# Altium schematic sheet Rail_3.SchDoc: Half Bridge 3
size A4; DocumentNumber: 5; Revision: 1.1; SheetNumber: 5; SheetTotal: 6
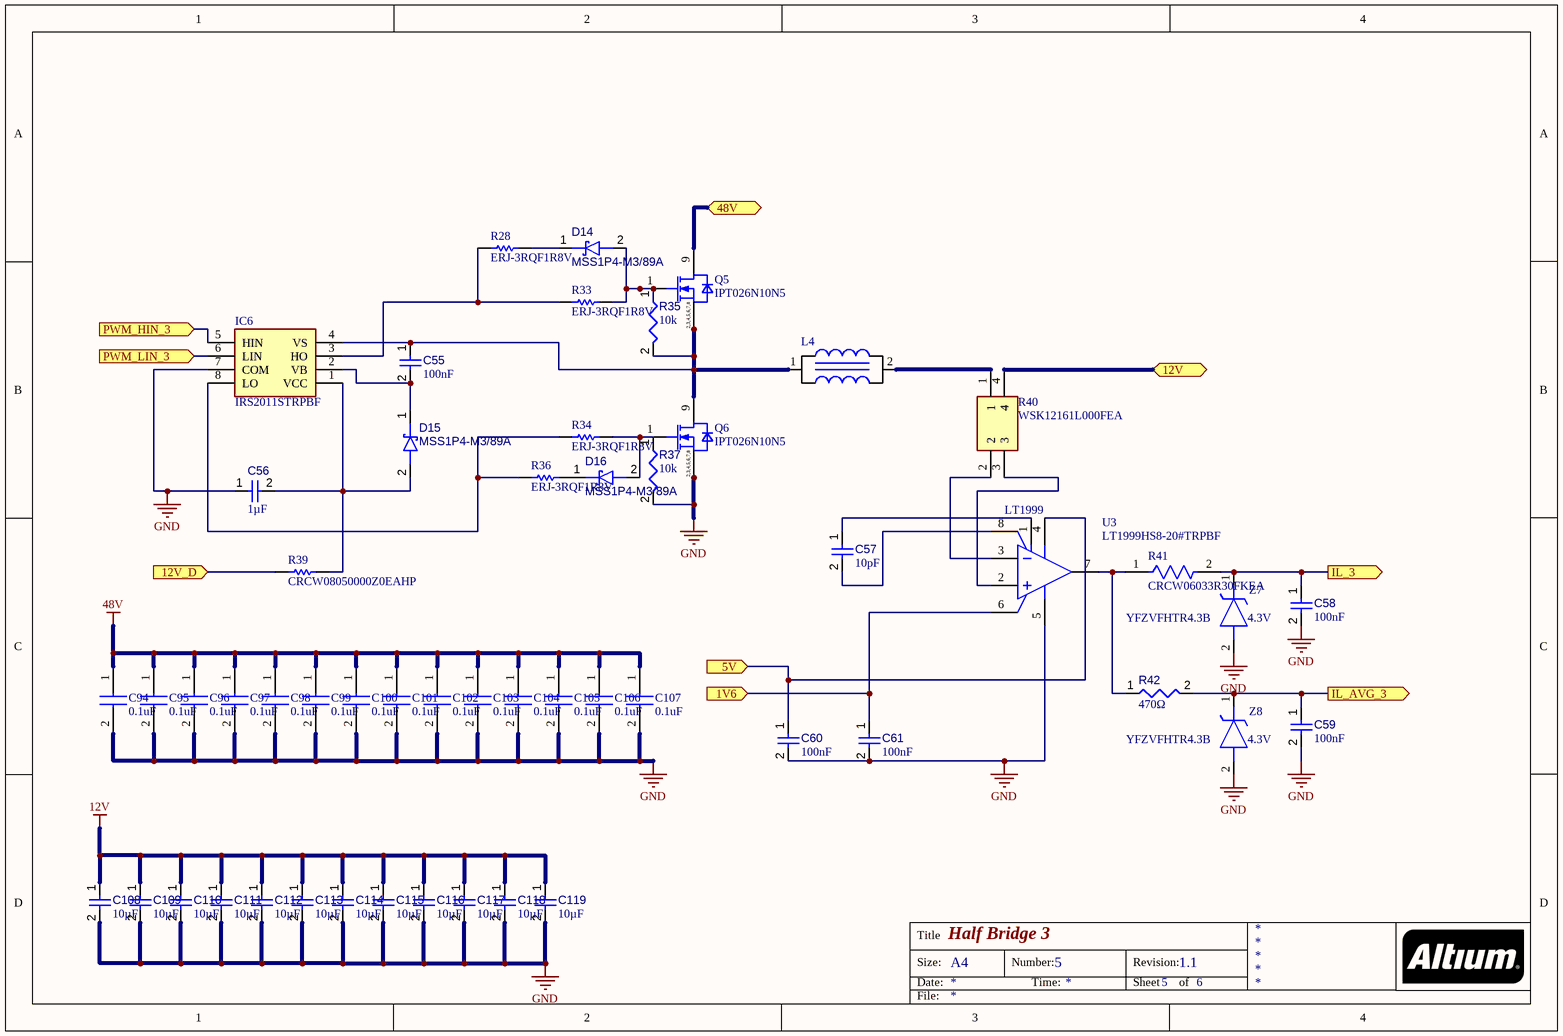
[diagram p0: Rail_3.SchDoc]

## Parts
C55  value 100nF  [CAPC1608X90X40ML10T20]  (hidden comment: Capacitor 100 nF +/-10% 50 V 0603)
C56  value 1µF  [CAPC0603(1608)100_L]  (hidden comment: Capacitor 1µF +/-0.1% 25V 0603)
C57  value 10pF  [CAPC1608X87X35ML15T15]  (hidden comment: Capacitor 10 pF +/- 0.25 pF 50 V 0603)
C58  value 100nF  [CAPC1608X90X40ML10T20]  (hidden comment: Capacitor 100 nF +/-10% 50 V 0603)
C59  value 100nF  [CAPC1608X90X40ML10T20]  (hidden comment: Capacitor 100 nF +/-10% 50 V 0603)
C60  value 100nF  [CAPC1608X90X40ML10T20]  (hidden comment: Capacitor 100 nF +/-10% 50 V 0603)
C61  value 100nF  [CAPC1608X90X40ML10T20]  (hidden comment: Capacitor 100 nF +/-10% 50 V 0603)
C94  0.1uF  [CAPC1608X90N]
C95  0.1uF  [CAPC1608X90N]
C96  0.1uF  [CAPC1608X90N]
C97  0.1uF  [CAPC1608X90N]
C98  0.1uF  [CAPC1608X90N]
C99  0.1uF  [CAPC1608X90N]
C100  0.1uF  [CAPC1608X90N]
C101  0.1uF  [CAPC1608X90N]
C102  0.1uF  [CAPC1608X90N]
C103  0.1uF  [CAPC1608X90N]
C104  0.1uF  [CAPC1608X90N]
C105  0.1uF  [CAPC1608X90N]
C106  0.1uF  [CAPC1608X90N]
C107  0.1uF  [CAPC1608X90N]
C108  value 10µF  [CAPC0805(2012)145_L]  (hidden comment: Capacitor 10µF +/-20% 25V 0805)
C109  value 10µF  [CAPC0805(2012)145_L]  (hidden comment: Capacitor 10µF +/-20% 25V 0805)
C110  value 10µF  [CAPC0805(2012)145_L]  (hidden comment: Capacitor 10µF +/-20% 25V 0805)
C111  value 10µF  [CAPC0805(2012)145_L]  (hidden comment: Capacitor 10µF +/-20% 25V 0805)
C112  value 10µF  [CAPC0805(2012)145_L]  (hidden comment: Capacitor 10µF +/-20% 25V 0805)
C113  value 10µF  [CAPC0805(2012)145_L]  (hidden comment: Capacitor 10µF +/-20% 25V 0805)
C114  value 10µF  [CAPC0805(2012)145_L]  (hidden comment: Capacitor 10µF +/-20% 25V 0805)
C115  value 10µF  [CAPC0805(2012)145_L]  (hidden comment: Capacitor 10µF +/-20% 25V 0805)
C116  value 10µF  [CAPC0805(2012)145_L]  (hidden comment: Capacitor 10µF +/-20% 25V 0805)
C117  value 10µF  [CAPC0805(2012)145_L]  (hidden comment: Capacitor 10µF +/-20% 25V 0805)
C118  value 10µF  [CAPC0805(2012)145_L]  (hidden comment: Capacitor 10µF +/-20% 25V 0805)
C119  value 10µF  [CAPC0805(2012)145_L]  (hidden comment: Capacitor 10µF +/-20% 25V 0805)
D14  MSS1P4-M3/89A  [MicroSMP (DO-219AD)]
D15  MSS1P4-M3/89A  [MicroSMP (DO-219AD)]
D16  MSS1P4-M3/89A  [MicroSMP (DO-219AD)]
IC6  IRS2011STRPBF  [SOIC127P600X175-8N-12-V]
L4  Inductor (Ansys)  [Inductor-Footprint-1]  (value not drawn)
Q5  IPT026N10N5  [INF-PG-HSOF-8-1-0-V]
Q6  IPT026N10N5  [INF-PG-HSOF-8-1-0-V]
R28  ERJ-3RQF1R8V  [RESC1608X55X30LL15T15]
R33  ERJ-3RQF1R8V  [RESC1608X55X30LL15T15]
R34  ERJ-3RQF1R8V  [RESC1608X55X30LL15T15]
R35  value 10k  [RESC1608X55X25ML10T15]  (hidden comment: Resistor 10k +/-1% 0603 100 mW)
R36  ERJ-3RQF1R8V  [RESC1608X55X30LL15T15]
R37  value 10k  [RESC1608X55X25ML10T15]  (hidden comment: Resistor 10k +/-1% 0603 100 mW)
R39  CRCW08050000Z0EAHP  [RESC2013X50X30ML20T20]
R40  WSK12161L000FEA  [WSK12161L000FEA]
R41  CRCW06033R30FKEA  [FP-CRCW0603-e3-IPC_C]
R42  value 470Ω  [RESC0805(2012)_L]  (hidden comment: 470R5J)
U3  LT1999HS8-20#TRPBF  [LT-S8-8_L]
Z7  YFZVFHTR4.3B  [YFZVFHTR43B]
Z8  YFZVFHTR4.3B  [YFZVFHTR43B]

## Ports
1V6 (in), 5V (in), 12V (bidir), 12V_D (in), 48V (bidir), IL_3 (out), IL_AVG_3 (out), PWM_HIN_3 (in), PWM_LIN_3 (in)

## Nets
12V: C108.1 C109.1 C110.1 C111.1 C112.1 C113.1 C114.1 C115.1 C116.1 C117.1 C118.1 C119.1
48V: C94.1 C95.1 C96.1 C97.1 C98.1 C99.1 C100.1 C101.1 C102.1 C103.1 C104.1 C105.1 C106.1 C107.1
GND: C56.1 C58.2 C59.2 C60.2 C61.2 C94.2 C95.2 C96.2 C97.2 C98.2 C99.2 C100.2 C101.2 C102.2 C103.2 C104.2 C105.2 C106.2 C107.2 C108.2 C109.2 C110.2 C111.2 C112.2 C113.2 C114.2 C115.2 C116.2 C117.2 C118.2 C119.2 IC6.7(COM) Q6.2(SOURCE) Q6.3(SOURCE) Q6.4(SOURCE) Q6.5(SOURCE) Q6.6(SOURCE) Q6.7(SOURCE) Q6.8(SOURCE) R37.2 U3.5(GND) Z7.2(A) Z8.2(A)
1V6: C61.1 U3.6(REF) ; port 1V6
5V: C60.1 U3.4(V+) ; port 5V
12V: R40.4 ; port 12V  [a separate net that carries the same name]
12V_D: R39.1 ; port 12V_D
48V: Q5.9(DRAIN) ; port 48V  [a separate net that carries the same name]
IL_3: C58.1 R41.2 Z7.1(K) ; port IL_3
IL_AVG_3: C59.1 R42.2 Z8.1(K) ; port IL_AVG_3
PWM_HIN_3: IC6.5(HIN) ; port PWM_HIN_3
PWM_LIN_3: IC6.6(LIN) ; port PWM_LIN_3
NetC55_1: C55.1 IC6.4(VS) L4.1 Q5.2(SOURCE) Q5.3(SOURCE) Q5.4(SOURCE) Q5.5(SOURCE) Q5.6(SOURCE) Q5.7(SOURCE) Q5.8(SOURCE) Q6.9(DRAIN) R35.2
NetC55_2: C55.2 D15.1(K) IC6.2(VB)
NetC56_2: C56.2 D15.2(A) IC6.1(VCC) R39.2
NetC57_1: C57.1 U3.1(V+)
NetC57_2: C57.2 U3.8(~{SHDN})
NetD14_1: D14.1(K) R28.2
NetD14_2: D14.2(A) Q5.1(GATE) R33.2 R35.1
NetD16_1: D16.1(K) R36.2
NetD16_2: D16.2(A) Q6.1(GATE) R34.2 R37.1
NetIC6_3: IC6.3(HO) R28.1 R33.1
NetIC6_8: IC6.8(LO) R34.1 R36.1
NetL4_2: L4.2 R40.1
NetR40_2: R40.2 U3.3(-IN)
NetR40_3: R40.3 U3.2(+IN)
NetR41_1: R41.1 R42.1 U3.7(OUT)

## Notes on the sheet
- (near U3) LT1999
- (near Z7) 4.3V
- (near Z8) 4.3V
- Title
- Size:
- Date:
- A4
- Number:
- Time:
- Revision:
- Sheet
- of
- File:
- (in symbol IPT026N10N5) 2,3,4,5,6,7,8

## Library data of the parts
C55 C58-C61 = CMP-001-00017-4: Chip Capacitor, 100 nF, +/- 10%, 50 V, 0603 (1608 Metric); Capacitor Type: Ceramic; Voltage Rating: 50V; RoHS Compliant: True; Max Operating Temperature: 125°C; Pins: 2; Mounting Technology: SM; Min Operating Temperature: -55°C; Tolerance: 10%; Case/Package: 0603
C56 = CMP-001-00055-2: Chip Capacitor, 1µF +/-0.1%, 25V, 0603, Thickness 1 mm; Tolerance: 20%; Max Operating Temperature: 85°C; Voltage Rating: 25V; Min Operating Temperature: -55°C; Case/Package: 0805; Mounting Technology: SMT; Pins: 2
C57 = CMP-001-00012-4: Chip Capacitor, 10 pF, +/- 0.25 pF, 50 V, 0603 (1608 Metric); Tolerance: 0.25%; Capacitor Type: Ceramic; Voltage Rating: 50V; Min Operating Temperature: -55°C; Mounting Technology: SM; RoHS Compliant: True; Case/Package: 0603; Pins: 2; Max Operating Temperature: 125°C
C94-C107 = 06031C104K4T2A: Capacitor; Manufacturer_Name: AVX; Datasheet Link: https://componentsearchengine.com/Datasheets/1/06031A100FAT2A.pdf; Height: 0.9mm; Manufacturer_Part_Number: 06031C104K4T2A; Mouser Part Number: 581-06031C104K4T2A; Mouser Price/Stock: https://www.mouser.co.uk/ProductDetail/AVX/06031C104K4T2A?qs=7MVldsJ5UaycASOsZ6%2FbJQ%3D%3D
C108-C119 = CMP-001-00079-2: Chip Capacitor, 10µF +/-20%, 25V, 0805, Thickness 1.45 mm; Tolerance: 10%; Pins: 2; Max Operating Temperature: 85°C; Mounting Technology: SMT; Case/Package: 0603; Voltage Rating: 25V; Min Operating Temperature: -55°C
D14-D16 = CMP-004-00024-2: Schottky Diodes & Rectifiers 1.0 Amp 40 Volt; Max Surge Current: 25A; Forward Voltage: 460mV; Pins: 2; Min Operating Temperature: -55°C; Max Operating Temperature: 150°C; Mounting Technology: SMT
IC6 = IRS2011STRPBF: Integrated Circuit; Manufacturer_Name: Infineon; Datasheet Link: https://componentsearchengine.com/Datasheets/1/IRS2011STRPBF.pdf; Height: 1.75mm; Manufacturer_Part_Number: IRS2011STRPBF; Arrow Part Number: IRS2011STRPBF; Arrow Price/Stock: https://www.arrow.com/en/products/irs2011strpbf/infineon-technologies-ag; Mouser Part Number: 942-IRS2011STRPBF; Mouser Price/Stock: https://www.mouser.co.uk/ProductDetail/Infineon-IR/IRS2011STRPBF?qs=9%252BKlkBgLFf3Y4ge8A0TwYQ%3D%3D
L4 = CMP-006-00021-3: Ansys 3D Model
Q5 Q6 = IPT026N10N5: Insulated-Gate Field-Effect Transistor (IGFET), N-Channel, Enhancement, Body Diode, Pin 1 Gate, 2-8 Source, 9 Drain, 9 Pins; Manufacturer: Infineon Technologies; PackageReference: PG-HSOF-8-1; ManufacturerPartNumber: IPT026N10N5
R28 R33 R34 R36 = CMP-2000-00844-1: Manufacturer: Panasonic; Part Number: ERJ-3RQF1R8V
R35 R37 = CMP-009-00017-4: Chip Resistor, 10 KOhm, +/- 1%, 01 W, -55 to 155 degC, 0603 (1608 Metric); Voltage Rating: 50V; Power: 100mW; Min Operating Temperature: -55°C; Tolerance: 1%; Case/Package: 0603; Pins: 2; Max Operating Temperature: 155°C; RoHS Compliant: True; Mounting Technology: SM
R39 = CMP-2001-04185-1: Manufacturer: Vishay Dale; Part Number: CRCW08050000Z0EAHP
R40 = WSK12161L000FEA: Resistor; Manufacturer_Name: Vishay; Datasheet Link: http://www.vishay.com/docs/30189/wsk1216.pdf; Height: 1.9mm; Manufacturer_Part_Number: WSK12161L000FEA; Arrow Part Number: WSK12161L000FEA; Arrow Price/Stock: https://www.arrow.com/en/products/wsk12161l000fea/vishay; Mouser Part Number: 71-WSK12161L000FEA; Mouser Price/Stock: https://www.mouser.co.uk/ProductDetail/Vishay-Dale/WSK12161L000FEA?qs=jj7GbYRQuOayzWPPW7c8og%3D%3D
R41 = CMP-1012-00228-3: RES Thick Film, 3.3Ω, 1%, 0.1W, 100ppm/°C, 0603; Resistance: 3.3R; Max Power Dissipation: 100mW; Voltage Rating: 75V; Case Code (Imperial): 0603; Width: 0.85mm; Number of Terminations: 2; REACH SVHC: No SVHC; Case/Package: 0603; Package Quantity: 10; Radiation Hardening: No; Min Operating Temperature: -55°C; Max Operating Temperature: 155°C; Composition: Thick Film; Termination: SMD/SMT; Tolerance: 1%; Military Standard: Not; Weight: 7.1E-05oz; Contact Plating: Tin; Packaging: Tape and Reel; Power Rating: 100mW; Height: 0.02inch; Length: 1.55mm; Voltage Rating (DC): 75V; Temperature Coefficient: 100ppm/°C; Case Code (Metric): 1608; Depth: 0.85mm; Lead Free: Lead Free; Features: Automotive AEC-Q200
R42 = CMP-009-00102-1: 470R 0.125W 5% 0805 (2012 Metric)  SMD; Power: 0.125W; Tolerance: 5%; Mounting Technology: SMT; Case/Package: 0805; Pins: 2
U3 = CMP-0359-03344-2: Single Channel, High Voltage, Bidirectional Current Sense Amplifier, 2 MHz Typical GBW, 3 V/us Typical SR, 4.5 to 5.5 V, 8-Pin SOIC (S8-8), High Temperature / Automotive, Pb-Free, Reel; Linear Technology Part Number: LT1999-20; Manufacturer: Linear Technology; Channels (#): 1; GBW (MHz) Typical: 2; Is (mA) Typical: 1.55; Vs Max (V): 5.5; SR (V/us) Typical: 3; Vos (mV) Typical: 0.5; Vs Min (V): 4.5; ComponentLink2Description: Datasheet; RoHS: Pb-Free; ComponentLink1URL: http://www.linear.com/; Type: CSA; DatasheetVersion: Rev. B; ComponentLink3URL: http://cds.linear.com/docs/en/packaging/05081610_G_SO8.pdf; ComponentLink1Description: Manufacturer URL; PackageReference: LT-S8-8; PackageVersion: Rev G; PartNumber: LT1999HS8-20#TRPBF; RevisionNote: URLs updated; Packing: Reel; PackageDescription: 8-Pin Plastic Small Outline, Body 4.9 x 3.9 mm, Pitch 1.27 mm; ComponentLink3Description: Package Specification; Mounting Technology: Surface Mount; ComponentLink2URL: http://cds.linear.com/docs/en/datasheet/1999fb.pdf
Z7 Z8 = YFZVFHTR4.3B: Zener Diode; Manufacturer_Name: ROHM Semiconductor; Datasheet Link: https://componentsearchengine.com/Datasheets/2/YFZVFHTR4.3B.pdf; Height: 0.8mm; Manufacturer_Part_Number: YFZVFHTR4.3B; Mouser Part Number: 755-YFZVFHTR4.3B; Mouser Price/Stock: https://www.mouser.co.uk/ProductDetail/ROHM-Semiconductor/YFZVFHTR43B?qs=4v%252BiZTmLVHGVnMzHBrJLew%3D%3D